# EAGLE design E-Slushy (EAGLE 6.6.0)
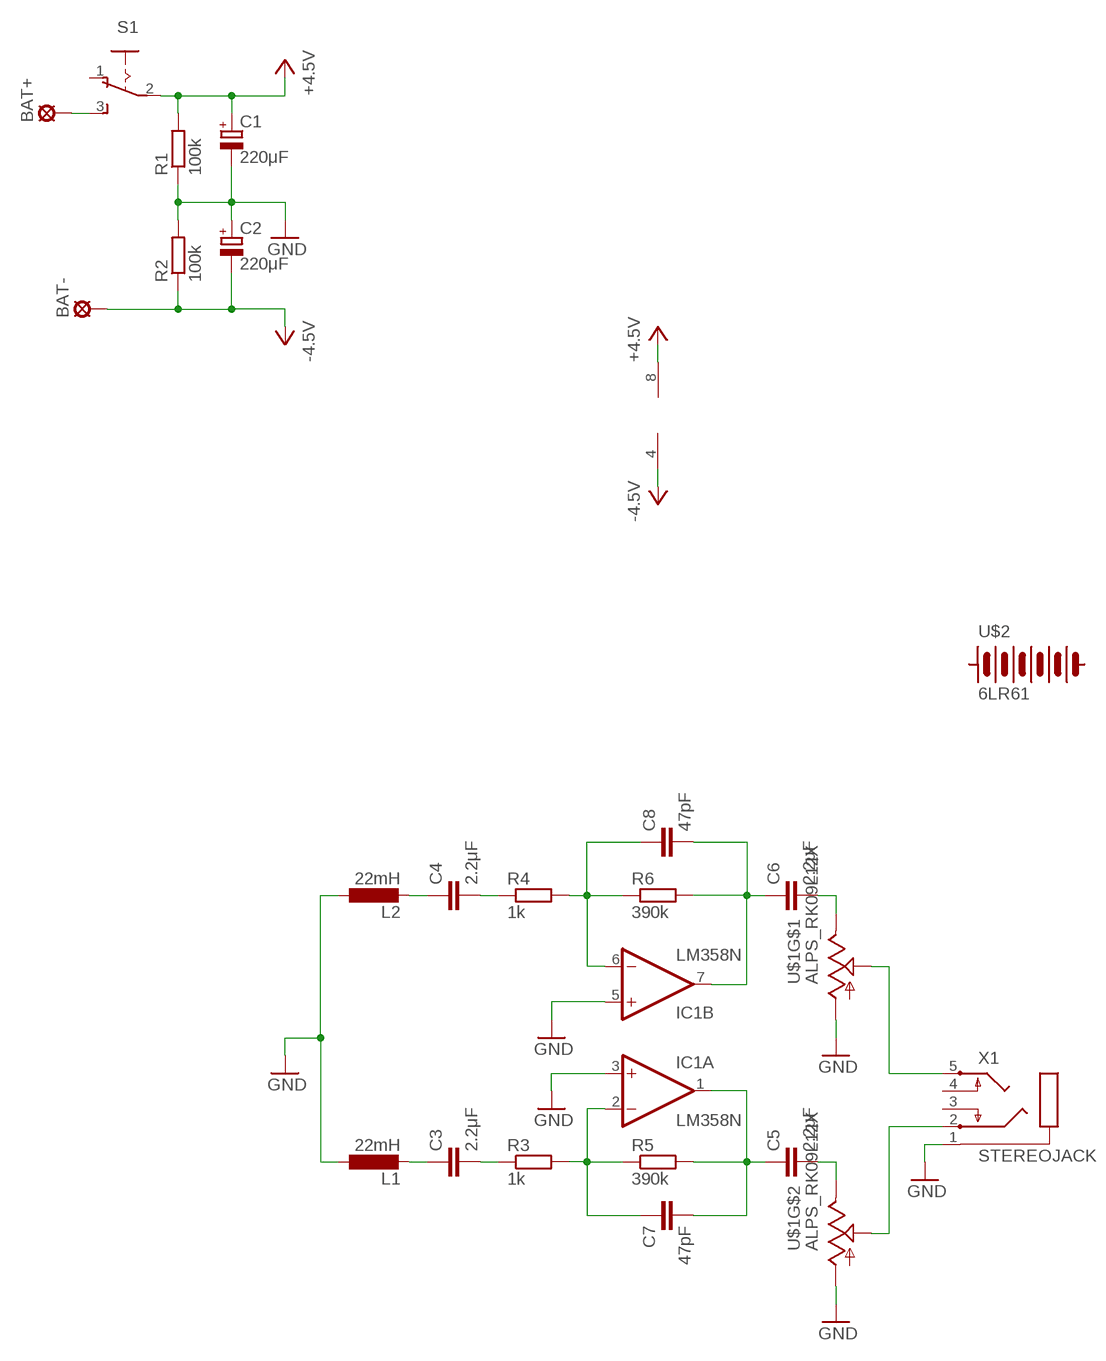
[diagram p0: schematic, sheet 1]

## Parts
BAT+  SE14  [SE14]
BAT-  SE14  [SE14]
C1  220μF  CPOL-EUD  [PANASONIC_D]
C2  220μF  CPOL-EUD  [PANASONIC_D]
C3  2.2μF  C-EUC1206K  [C1206K]
C4  2.2μF  C-EUC1206K  [C1206K]
C5  2.2μF  C-EUC1206K  [C1206K]
C6  2.2μF  C-EUC1206K  [C1206K]
C7  47pF  C-EUC1206K  [C1206K]
C8  47pF  C-EUC1206K  [C1206K]
IC1  LM358N  [DIL08]
L1  22mH  L-EU6000-XXX-RC  [6000-XXXX-RC]
L2  22mH  L-EU6000-XXX-RC  [6000-XXXX-RC]
R1  100k  R-EU_R1206  [R1206]
R2  100k  R-EU_R1206  [R1206]
R3  1k  R-EU_R1206  [R1206]
R4  1k  R-EU_R1206  [R1206]
R5  390k  R-EU_R1206  [R1206]
R6  390k  R-EU_R1206  [R1206]
S1  255SB  [255SB]
U$1  ALPS_RK09L12X  [RK09L12]
U$2  6LR61  [6LR61]
X1  STEREOJACK  [STX3100]

## Nets
+4.5V: C1.+ IC1.8(P:V+) R1.2 S1.2(P)
-4.5V: BAT-.MP C2.- IC1.4(P:V-) R2.1
GND: C1.- C2.+ IC1.3(A:+IN) IC1.5(B:+IN) L1.1 L2.1 R1.1 R2.2 U$1.A1 U$1.B1 X1.1
N$1: C3.1 L1.2
N$2: C3.2 R3.1
N$3: C4.1 L2.2
N$4: C4.2 R4.1
N$5: C7.1 IC1.2(A:-IN) R3.2 R5.1
N$6: C5.1 C7.2 IC1.1(A:OUT) R5.2
N$7: C8.1 IC1.6(B:-IN) R4.2 R6.1
N$8: C6.1 C8.2 IC1.7(B:OUT) R6.2
N$9: C5.2 U$1.B3
N$10: C6.2 U$1.A3
N$11: U$1.B2 X1.2
N$12: U$1.A2 X1.5
N$13: BAT+.MP S1.3(S)
Unconnected: S1.1(O) X1.3 X1.4

## Library data of the parts
BAT+ BAT- = solpad:SE14: SOLDER PAD E1553, drill 1,4mm, distributor Buerklin, 07F820
C1 C2 = rcl:CPOL-EU: POLARIZED CAPACITOR, European symbol
C3-C8 = rcl:C-EU: CAPACITOR, European symbol
IC1 = linear:LM358: OP AMP also LM158; LM258; LM2904 Source: http://cache.national.com/ds/LM/LM158.pdf
L1 L2 = rcl:L-EU: INDUCTOR, European symbol
R1-R6 = rcl:R-EU_: RESISTOR, European symbol
S1 = switch:255SB: SLIDING SWITCH Distributor Buerklin, 11G810
U$1 = audio-pots:ALPS_RK09L12X
U$2 = battery:6LR61
X1 = adafruit:STEREOJACK: MIC/HEADPHONE JACK Stereo jack with two switches. Kycon STX3100, CUI SJ1-3555NG and/or 4UCon 05544

## Board
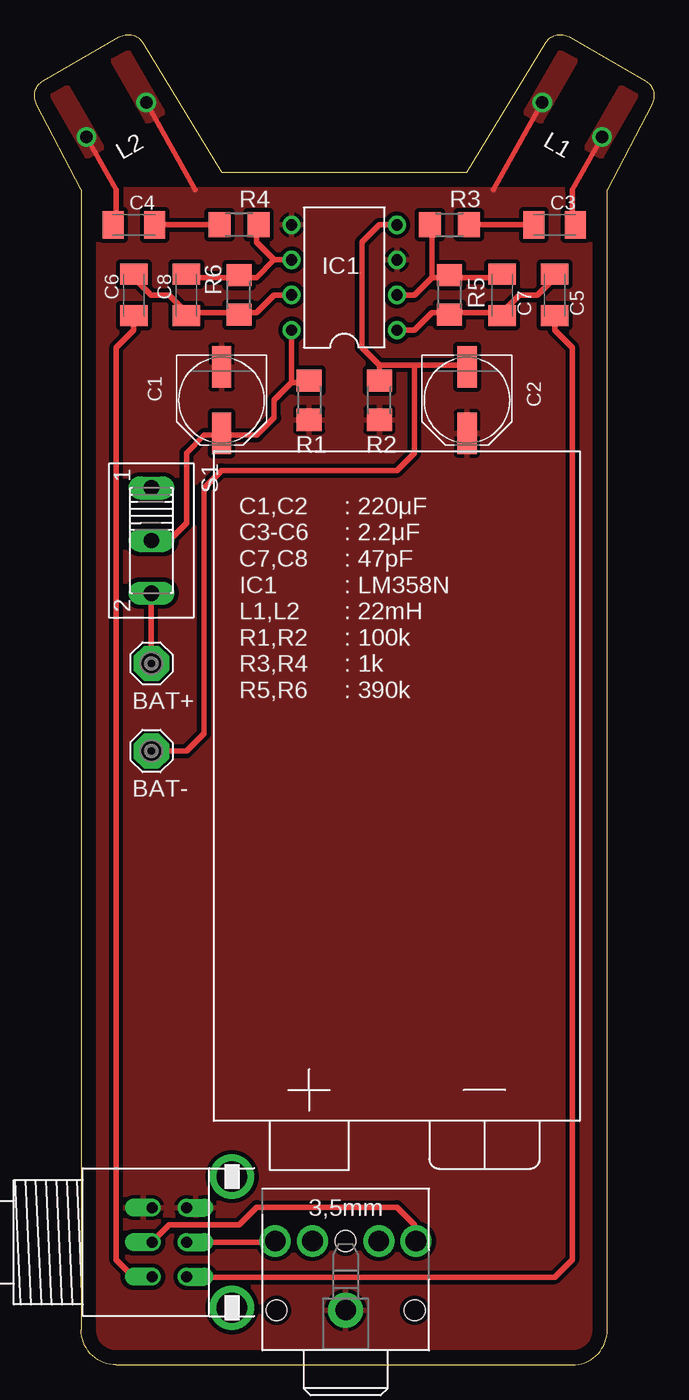
[diagram p1: board, top side]
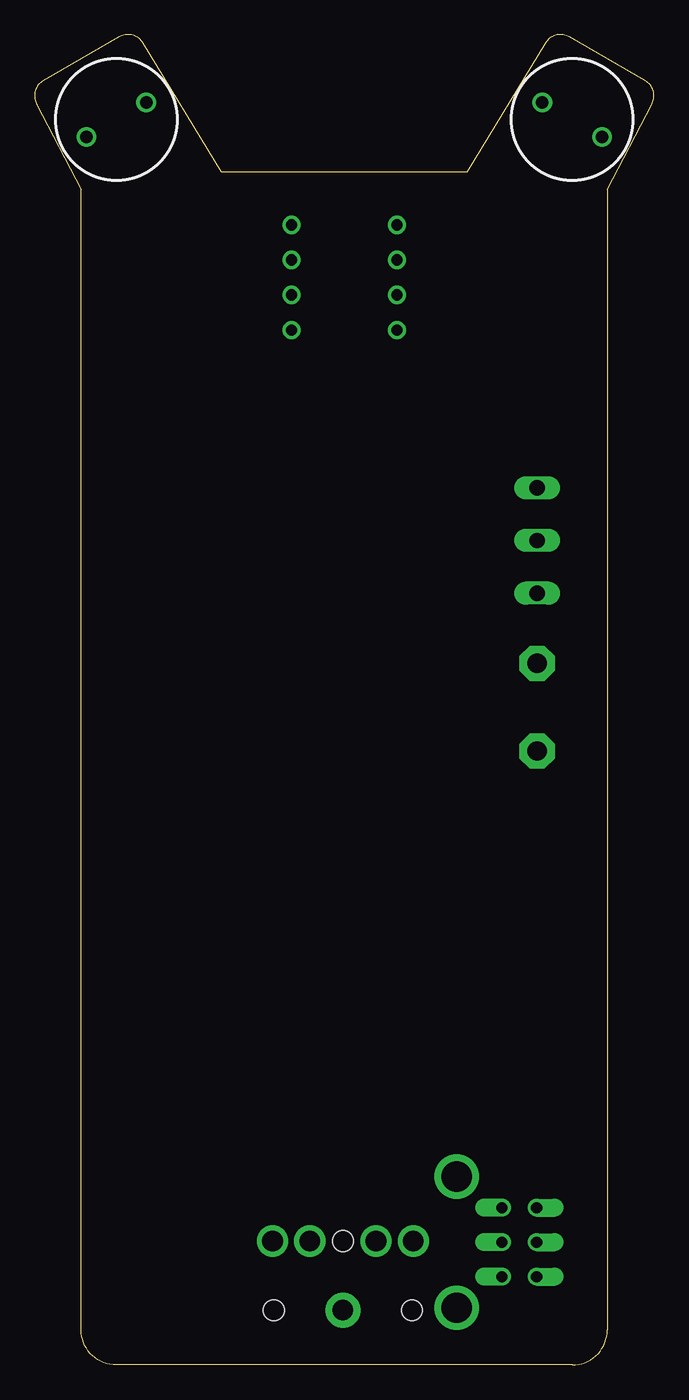
[diagram p2: board, bottom side, seen from below]

Size 44.87 x 96.33 mm. Coordinates in mm from the lower left corner, seen from the top.
Outline: 5.92,0 arc-90 3.38,2.54 3.38,85.09 0.17,91.25 arc-90 0.63,92.98 6.13,96.16 arc-90 7.87,95.69 13.54,86.36 31.32,86.36 37,95.69 arc-90 38.73,96.16 44.23,92.98 arc-90 44.7,91.25 41.48,85.09 41.48,2.54 arc-90 38.94,0 5.92,0
Copper layers (1*16): Top 0.035mm / dielectric 1.5mm / Bottom 0.035mm
Design rules "SeeedStudio_2layer_DRU_no_angle_20140221": minimum track width 6mil, minimum drill 12mil, track to track 6mil, track to pad 6mil, pad to pad 6mil, via to via 6mil, smd to smd 0mil, copper to edge 10mil, drill to drill 10mil, minimum pad ring 10mil, minimum via ring 6mil, stop-mask expansion 2mil, vias tented up to drill 100mil, thermal gap 10mil

### Footprints (pad centres in the part's own frame; a part is rotated, then mirrored left to right if it is on the bottom)
SE14 = drill 1.397 pad 2.54 octagon: MP 0,0
PANASONIC_D = smd 3 x 1.4: + 2.4,0; - -2.4,0
C1206K = smd 1.5 x 2: 1 -1.5,0; 2 1.5,0
DIL08 = drill 0.813 pad 1.27: 1 -3.81,-3.81; 2 -1.27,-3.81; 3 1.27,-3.81; 4 3.81,-3.81; 5 3.81,3.81; 6 1.27,3.81; 7 -1.27,3.81; 8 -3.81,3.81
6000-XXXX-RC = drill 0.9 pad 1.422: 1 -2.5,0; 2 2.5,0
R1206 = smd 1.6 x 1.803: 1 -1.422,0; 2 1.422,0
255SB = drill 1.118 long: 1 -3.81,0; 2 0,0; 3 3.81,0
RK09L12 = drill 0.8 offset: A1 2.5,2.5; A2 0,2.5; A3 -2.5,2.5; B1 2.5,0; B2 0,0; B3 -2.5,0 | drill 2.2 pad 3: P$1 -4.75,-3.3; P$2 4.75,-3.3
STX3100 = drill 1.5 pad 2.54: 1 2.7,-0.1 | drill 1.5: 2 7.7,5; 3 7.7,2.3; 4 7.7,-2.5; 5 7.7,-5.2 | hole 1.5: 2.7,4.9; 2.7,-5.1; 7.7,-0.1

### Placement (x,y rotation side)
BAT+  8.46,50.8 0 top
BAT-  8.46,44.45 0 top
C1  13.54,69.85 270 top
C2  31.32,69.85 270 top
C3  37.67,82.55 180 top
C4  7.19,82.55 0 top
C5  37.67,77.47 270 top
C6  7.19,77.47 270 top
C7  33.86,77.47 270 top
C8  11,77.47 270 top
IC1  22.43,78.74 90 top
L1  38.94,90.17 210 bottom
L2  5.92,90.17 330 bottom
R1  19.89,69.85 90 top
R2  24.97,69.85 270 top
R3  30.05,82.55 180 top
R4  14.81,82.55 0 top
R5  30.05,77.47 270 top
R6  14.81,77.47 270 top
S1  8.46,59.69 270 top
U$1  11,8.89 90 top
U$2  26.24,41.91 180 top
X1  22.43,1.27 90 top

### Tracks (layer width: path | path; a pad name or v marks a point on that pad's centre or on a via)
+4.5V
  Top 0.406: S1.2 9.73,59.69 11,60.96 11,66.04 12.27,67.31 13.54,67.31 | IC1.8 18.62,71.12 | 18.62,71.12 19.89,71.12 R1.2 | C1.+ 13.54,67.31 | 13.54,67.31 16.08,67.31 17.35,68.58 17.35,69.85 18.62,71.12
-4.5V
  Top 0.406: IC1.4 24.97,82.55 23.7,81.28 23.7,73.66 24.97,72.39 | BAT-.MP 11,44.45 12.27,45.72 12.27,63.5 13.54,64.77 26.24,64.77 27.51,66.04 27.51,72.39 | 24.97,72.39 R2.1 | C2.- 31.32,72.39 27.51,72.39 | 27.51,72.39 24.97,72.39
GND
  Top 0.406: L2.1 11.64,85.09 | L1.1 33.23,85.09
  pour Top (isolate 0.305): 4.65,85.09 4.65,2.54 arc90 5.92,1.27 38.94,1.27 arc90 40.21,2.54 40.21,85.09
  pour Top (no thermals): 9.31,90.66 8.21,90.02 5.67,94.42 6.77,95.06
  pour Top (no thermals): 36.66,90.02 35.56,90.66 38.1,95.06 39.2,94.42
N$1
  Top 0.406: C3.1 38.94,82.55 38.94,85.09 L1.2
  pour Top (no thermals): 41.06,87.48 39.96,88.12 42.5,92.52 43.6,91.88
N$2
  Top 0.406: R3.1 C3.2
N$3
  Top 0.406: L2.2 5.92,85.09 5.92,82.55 C4.1
  pour Top (no thermals): 4.91,88.12 3.81,87.48 1.27,91.88 2.37,92.52
N$4
  Top 0.406: C4.2 R4.1
N$5
  Top 0.406: C7.1 33.86,78.74 30.05,78.74 | IC1.2 27.51,77.47 28.78,78.74 | R3.2 28.78,82.55 28.78,78.74 | 28.78,78.74 30.05,78.74 | 30.05,78.74 R5.1
N$6
  Top 0.406: 33.86,76.2 35.13,77.47 36.4,77.47 37.67,78.74 C5.1 | IC1.1 27.51,74.93 28.78,76.2 30.05,76.2 | C7.2 33.86,76.2 | 33.86,76.2 30.05,76.2 | 30.05,76.2 R5.2
N$7
  Top 0.406: IC1.6 17.35,80.01 | C8.1 11,78.74 14.81,78.74 | R4.2 16.08,82.55 16.08,81.28 17.35,80.01 | 17.35,80.01 16.08,78.74 14.81,78.74 | 14.81,78.74 R6.1
N$8
  Top 0.406: 11,76.2 14.81,76.2 | 14.81,76.2 R6.2 | 14.81,76.2 16.08,76.2 17.35,77.47 IC1.7 | C6.1 7.19,78.74 8.46,77.47 9.73,77.47 11,76.2 | 11,76.2 C8.2
N$9
  Top 0.406: U$1.B3 11,6.35 37.67,6.35 38.94,7.62 38.94,73.66 37.67,74.93 C5.2
N$10
  Top 0.406: U$1.A3 8.46,6.35 7.19,6.35 5.92,7.62 5.92,73.66 7.19,74.93 C6.2
N$11
  Top 0.406: X1.2 17.35,8.89 U$1.B2
N$12
  Top 0.406: U$1.A2 8.5,8.93 9.73,10.16 14.81,10.16 16.08,11.43 26.24,11.43 27.51,10.16 27.51,8.89 27.59,8.97 X1.5
N$13
  Top 0.406: BAT+.MP S1.3

### Text on the board
tNames: C1,C2 / C3-C6 / C7,C8 / IC1 / L1,L2 / R1,R2 / R3,R4 / R5,R6 | : 220μF / : 2.2μF / : 47pF / : LM358N / : 22mH / : 100k / : 1k / : 390k